# EasyEDA schematic 4 Channel Relay Board Omron.json

## Sheets
1 Relay Section copy: TITLE: Sheet_1; REV: 1.0; Date: 2022-12-17; Sheet: 1/1; Drawn By: Adarack; Company: Your Company
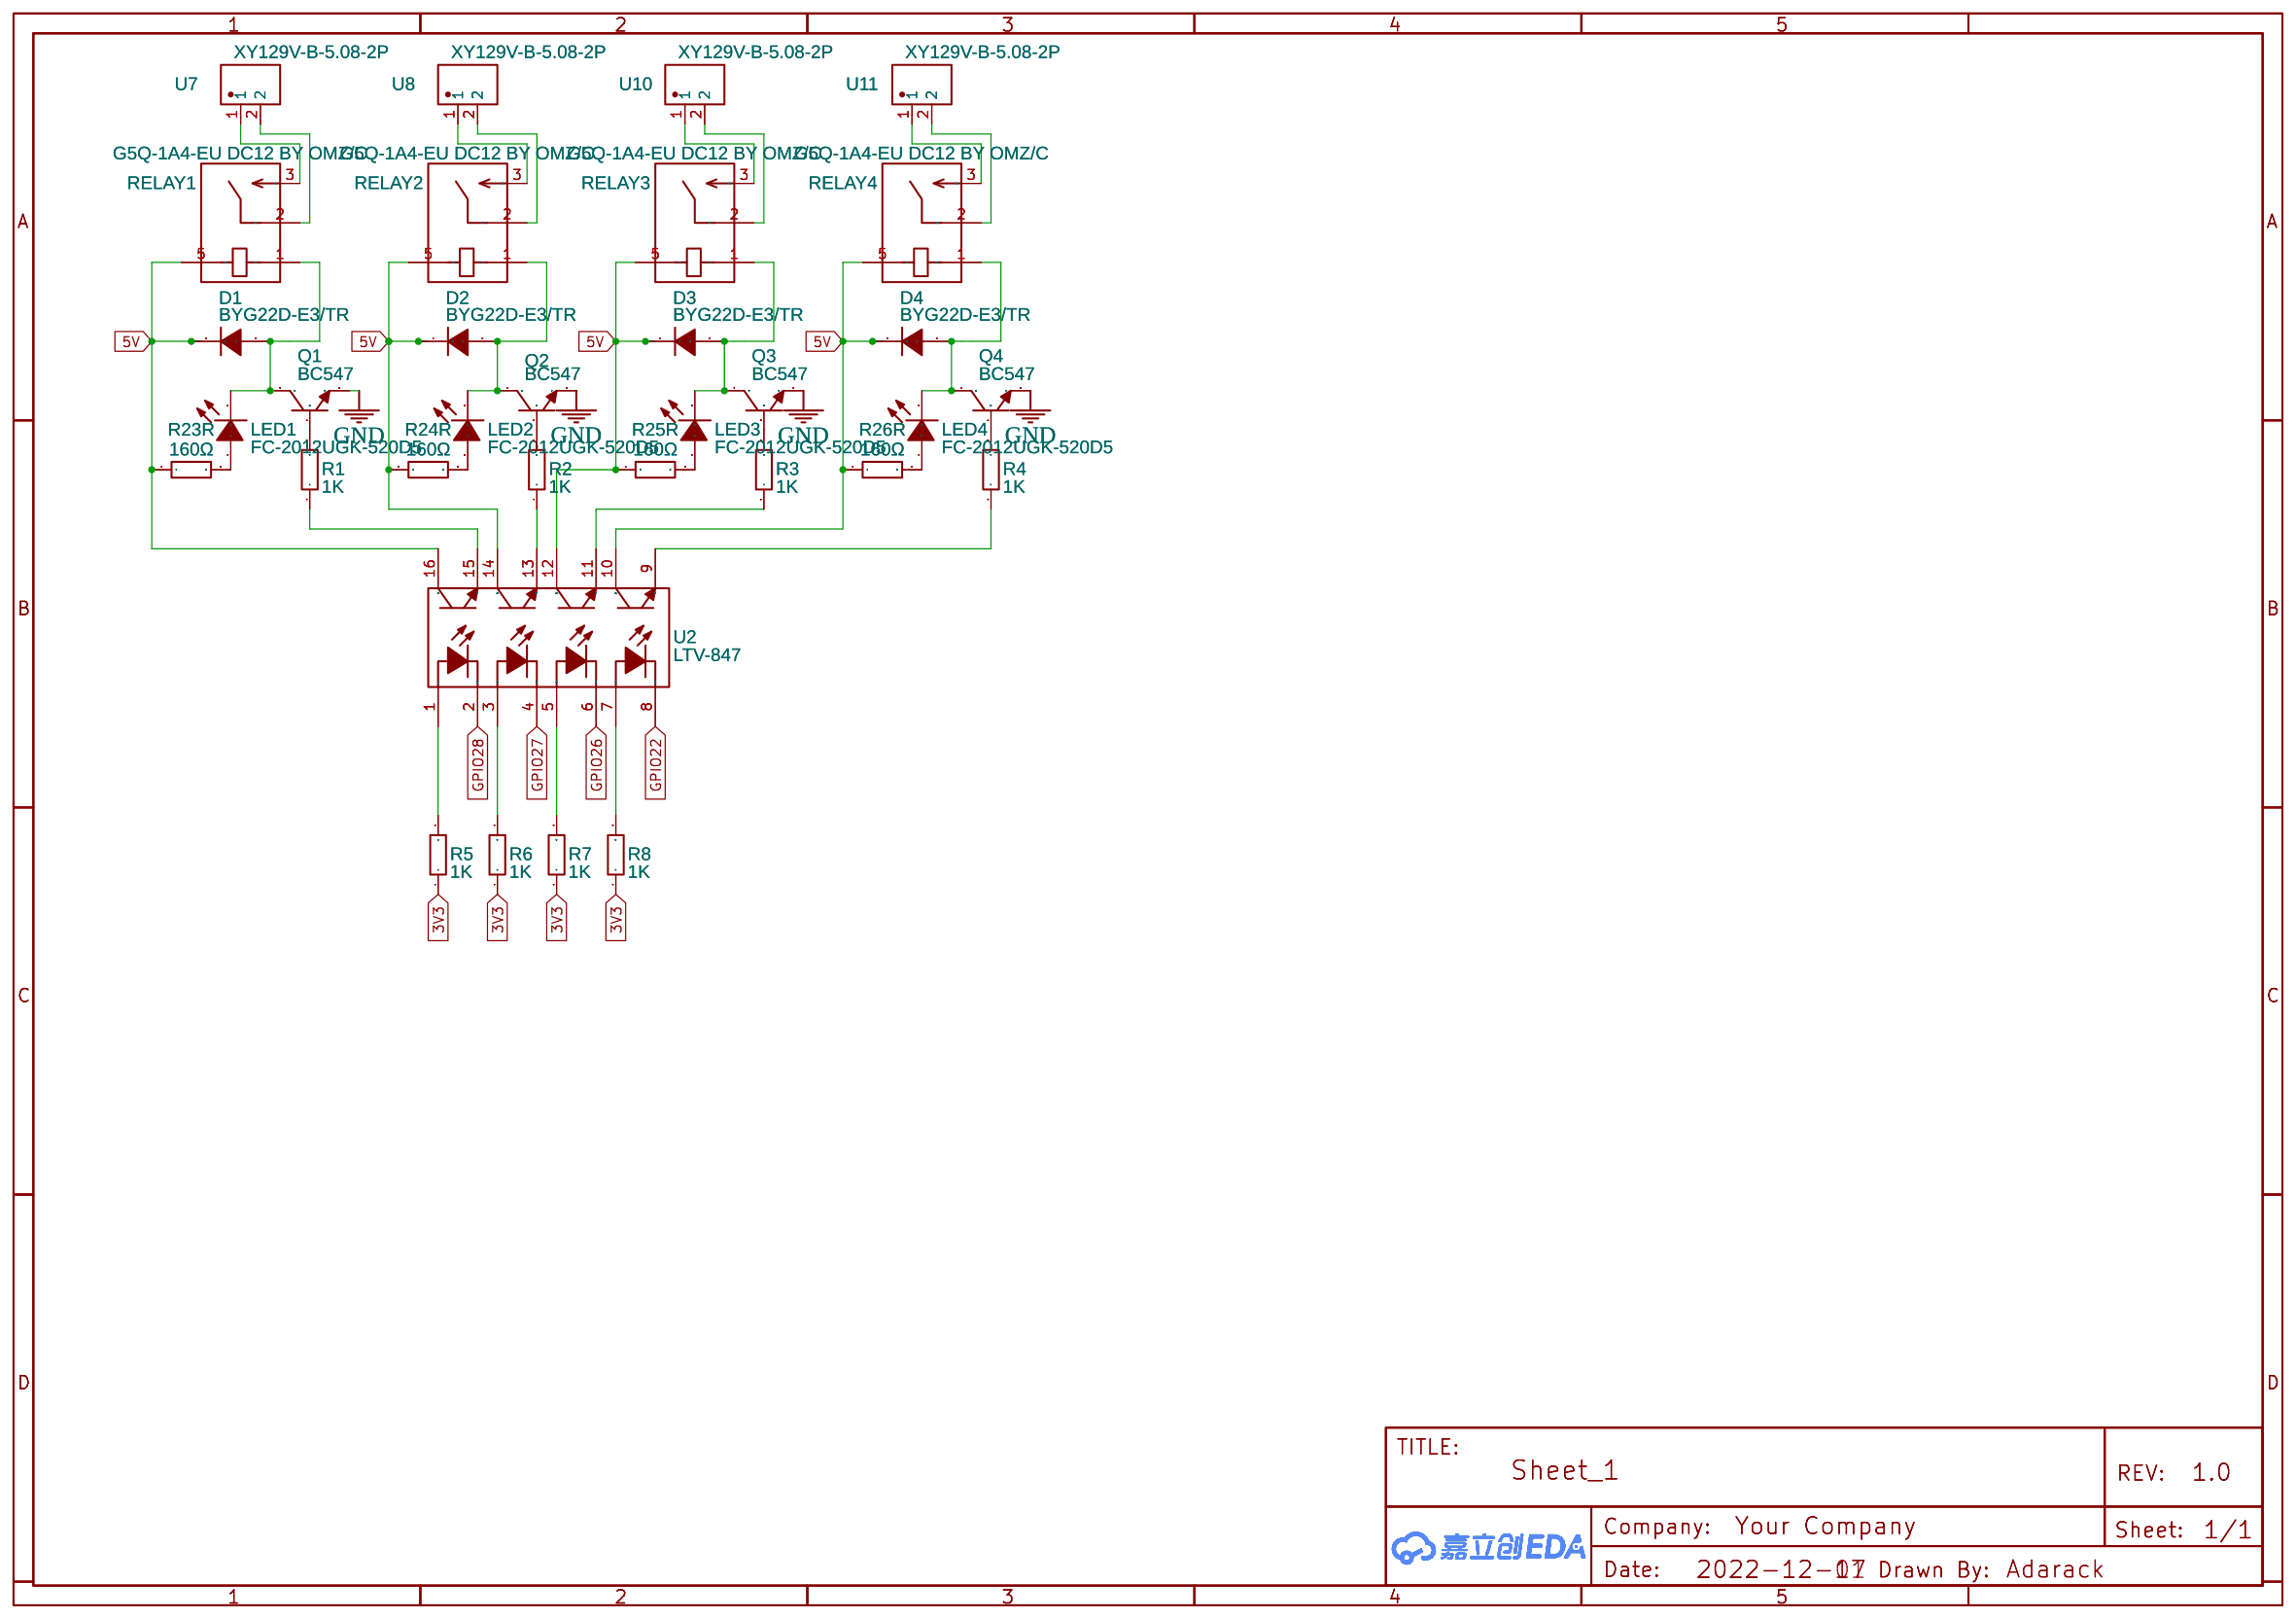
[diagram p0: Relay Section copy]
2 Pico W Section copy: TITLE: Sheet_2
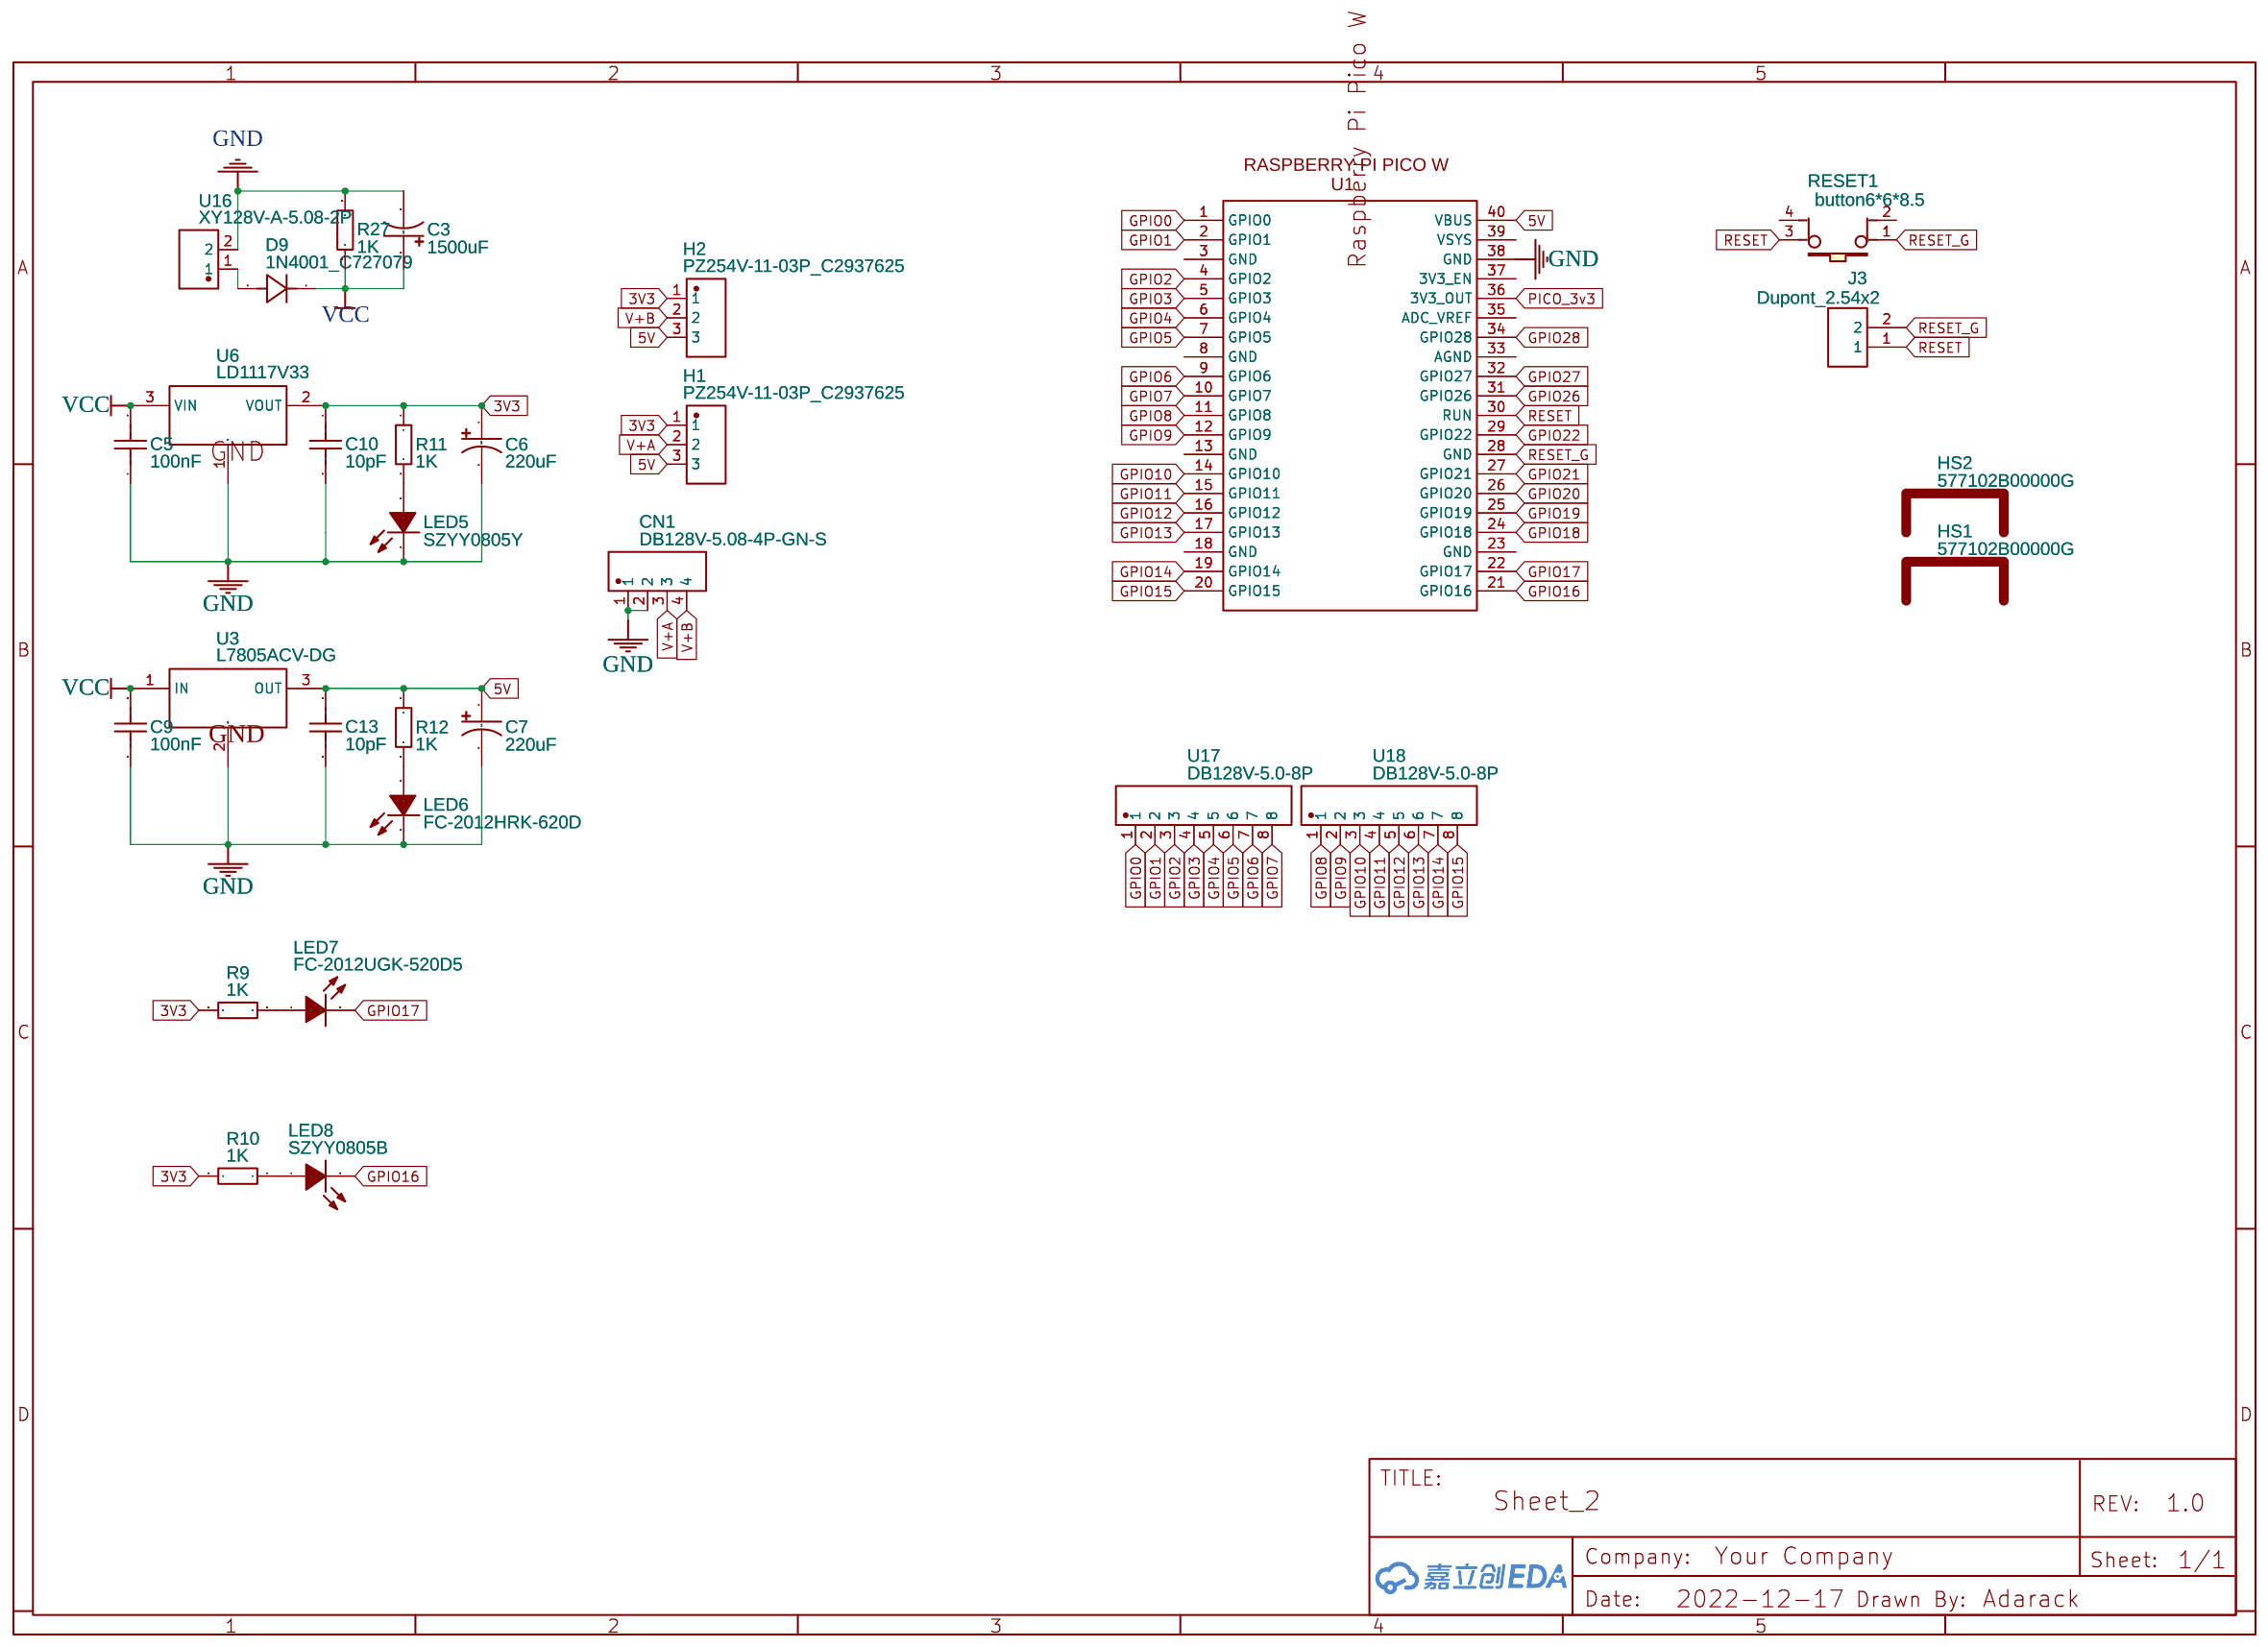
[diagram p1: Pico W Section copy]

## Parts
sheet Pico W Section copy
C3  1500uF  [CAP-TH_BD12.5-P5.00-D0.6-FD]
C5  100nF  [C0805]
C6  220uF  [CAP-TH_BD5.0-P2.00-D0.8-FD]
C7  220uF  [CAP-TH_BD5.0-P2.00-D0.8-FD]
C9  100nF  [C0805]
C10  10pF  [C0805]
C13  10pF  [C0805]
CN1  DB128V-5.08-4P-GN-S  [CONN-TH_4P-P5.08_DIBO_DB128V-5.08]
D9  1N4001_C727079  [SMA_L4.3-W2.5-LS5.0-RD]
H1  PZ254V-11-03P_C2937625  [HDR-TH_3P-P2.54-V-M]
H2  PZ254V-11-03P_C2937625  [HDR-TH_3P-P2.54-V-M]
HS1  577102B00000G  [577102B00000G]
HS2  577102B00000G  [577102B00000G]
J3  Dupont_2.54x2  [DUPONT 2.54_2]
LED5  SZYY0805Y  [LED0805-RD_YELLOW]
LED6  FC-2012HRK-620D  [LED0805-RD_RED]
LED7  FC-2012UGK-520D5  [LED0805-R-RD]
LED8  SZYY0805B  [LED0805-R-RD_BLUE]
R9  1K  [R0805]
R10  1K  [R0805]
R11  1K  [R0805]
R12  1K  [R0805]
R27  1K  [R0805]
RESET1  button6*6*8.5  [KEY-TH_4P-L6.0-W6.0-P4.50]
U3  L7805ACV-DG  [TO-220-3_L10.0-W4.5-P2.54-L]
U6  LD1117V33  [TO-220-3_L10.0-W4.5-P2.54-L]
U9  Raspberry Pi Pico W  [RASPBERRY PI PICO W HOLES CASTELLATED]
U16  XY128V-A-5.08-2P  [CONN-TH_XY128V-A-5.08-2P]
U17  DB128V-5.0-8P  [CONN-TH_8P-P5.00_DB128V-5.0-8P]
U18  DB128V-5.0-8P  [CONN-TH_8P-P5.00_DB128V-5.0-8P]
sheet Relay Section copy
D1  BYG22D-E3/TR  [SMA_L4.4-W2.8-LS5.4-RD]
D2  BYG22D-E3/TR  [SMA_L4.4-W2.8-LS5.4-RD]
D3  BYG22D-E3/TR  [SMA_L4.4-W2.8-LS5.4-RD]
D4  BYG22D-E3/TR  [SMA_L4.4-W2.8-LS5.4-RD]
LED1  FC-2012UGK-520D5  [LED0805-R-RD]
LED2  FC-2012UGK-520D5  [LED0805-R-RD]
LED3  FC-2012UGK-520D5  [LED0805-R-RD]
LED4  FC-2012UGK-520D5  [LED0805-R-RD]
Q1  BC547  [TO-92-3_L4.5-W3.5-P1.27-L]
Q2  BC547  [TO-92-3_L4.5-W3.5-P1.27-L]
Q3  BC547  [TO-92-3_L4.5-W3.5-P1.27-L]
Q4  BC547  [TO-92-3_L4.5-W3.5-P1.27-L]
R1  1K  [R0805]
R2  1K  [R0805]
R3  1K  [R0805]
R4  1K  [R0805]
R5  1K  [R0805]
R6  1K  [R0805]
R7  1K  [R0805]
R8  1K  [R0805]
R23R  160Ω  [R0805]
R24R  160Ω  [R0805]
R25R  160Ω  [R0805]
R26R  160Ω  [R0805]
RELAY1  G5Q-1A4-EU DC12 BY OMZ/C  [RELAY-TH_OMRON_G5Q-1A4-XX-XX-XX]
RELAY2  G5Q-1A4-EU DC12 BY OMZ/C  [RELAY-TH_OMRON_G5Q-1A4-XX-XX-XX]
RELAY3  G5Q-1A4-EU DC12 BY OMZ/C  [RELAY-TH_OMRON_G5Q-1A4-XX-XX-XX]
RELAY4  G5Q-1A4-EU DC12 BY OMZ/C  [RELAY-TH_OMRON_G5Q-1A4-XX-XX-XX]
U2  LTV-847  [DIP-16_16P-L20.2-W6.6-P2.54-LS7.6-BL]
U7  XY129V-B-5.08-2P  [CONN-TH_XY129V-B-5.08-2P]
U8  XY129V-B-5.08-2P  [CONN-TH_XY129V-B-5.08-2P]
U10  XY129V-B-5.08-2P  [CONN-TH_XY129V-B-5.08-2P]
U11  XY129V-B-5.08-2P  [CONN-TH_XY129V-B-5.08-2P]

## Library data of the parts
C3 = EGF158M1VI25RRSHP: Supplier: LCSC; Supplier Part: C238296; Manufacturer: Man Yue Tech; Contributor: LCSC; JLCPCB Part Class: Extended Part
C5 C9 = CC0805KRX7R8BB104: Supplier: LCSC; Supplier Part: C519981; Manufacturer: YAGEO(国巨); Contributor: LCSC; JLCPCB Part Class: Extended Part
C6 C7 = EEUFS0J221: Supplier: LCSC; Supplier Part: C407962; Manufacturer: PANASONIC(松下); Contributor: LCSC; JLCPCB Part Class: Extended Part
C10 C13 = 0805CG100J500NT: Supplier: LCSC; Manufacturer: FH(风华); Contributor: LCSC; Supplier Part: C157608; JLCPCB Part Class: Extended Part
CN1 = DB128V-5.08-4P-GN-S: Supplier: LCSC; Supplier Part: C2915641; Manufacturer: DIBO(地博电气); Contributor: LCSC; JLCPCB Part Class: Extended Part
D9 = 1N4001_C727079: Supplier: LCSC; Supplier Part: C727079; Manufacturer: TWGMC; Manufacturer Part: 1N4001; Contributor: LCSC; JLCPCB Part Class: Extended Part
H1 H2 = PZ254V-11-03P_C2937625: Supplier: LCSC; Supplier Part: C2937625; Manufacturer: XFCN(台湾兴飞); Manufacturer Part: PZ254V-11-03P; Contributor: LCSC; JLCPCB Part Class: Extended Part
HS1 HS2 = 577102B00000G: Manufacturer: Aavid; Supplier: Mouser; Supplier Part: 532-577102B00; Contributor: dylanmueller1302
J3 = Dupont_2.54x2: Contributor: govorukhin
LED5 = SZYY0805Y: Supplier: LCSC; Supplier Part: C434436; Manufacturer: yongyu(永裕光电); Contributor: LCSC; JLCPCB Part Class: Extended Part
LED6 = FC-2012HRK-620D: Supplier: LCSC; Manufacturer: NATIONSTAR; Supplier Part: C84256; JLCPCB Part Class: Basic Part
LED1-LED4 LED7 = FC-2012UGK-520D5: Supplier: LCSC; Manufacturer: 国星光电; Manufacturer Part: NCD0805G1; Supplier Part: C84260; JLCPCB Part Class: Extended Part
LED8 = SZYY0805B: Supplier: LCSC; Supplier Part: C434433; Manufacturer: yongyu(永裕光电); Contributor: LCSC; JLCPCB Part Class: Extended Part
R1-R12 R27 = RC0805FR-071KL: Supplier: LCSC; Manufacturer: YAGEO(国巨); Supplier Part: C95781; JLCPCB Part Class: Extended Part; Resistance: 1kΩ
RESET1 = button6*6*8.5: Supplier Part: C59980; Supplier: LCSC; Manufacturer: ReliaPro
U3 = L7805ACV-DG: Supplier: LCSC; Supplier Part: C472632; Manufacturer: STMicroelectronics; Contributor: LCSC; JLCPCB Part Class: Extended Part
U6 = LD1117V33: Supplier: LCSC; Supplier Part: C283467; Manufacturer: STMicroelectronics; Contributor: LCSC; JLCPCB Part Class: Extended Part
U9 = Raspberry Pi Pico W: Contributor: stienman
U16 = XY128V-A-5.08-2P: Supplier: LCSC; Supplier Part: C557665; Manufacturer: XINLAIYA(新莱亚); Contributor: LCSC; JLCPCB Part Class: Extended Part
U17 U18 = DB128V-5.0-8P: Supplier: LCSC; Supplier Part: C395863; Manufacturer: DIBO; Contributor: LCSC; JLCPCB Part Class: Extended Part
D1-D4 = BYG22D-E3/TR: Supplier: LCSC; Manufacturer: VISHAY(威世); Supplier Part: C52782; JLCPCB Part Class: Extended Part
Q1-Q4 = BC547: Supplier: LCSC; Supplier Part: C2910381; Manufacturer: CJ(江苏长电/长晶); link: https://atta.szlcsc.com/upload/public/pdf/source/20220322/35437BB3E522E0C3E451097265A180DC.pdf; Contributor: LCSC; JLCPCB Part Class: Extended Part
R23R R24R R25R R26R = 0805W8F1600T5E: Supplier: LCSC; Manufacturer: UNI-ROYAL(厚声); Supplier Part: C25269; Resistance (Ohms): 160; JLCPCB Part Class: Extended Part
RELAY1-RELAY4 = G5Q-1A4-EU DC12 BY OMZ/C: Supplier: LCSC; Supplier Part: C726027; Manufacturer: OMRON(欧姆龙); link: https://atta.szlcsc.comnull; Contributor: lcsc
U2 = LTV-847: Supplier: LCSC; Manufacturer: LITEON(光宝); Supplier Part: C10794; JLCPCB Part Class: Extended Part
U7 U8 U10 U11 = XY129V-B-5.08-2P: Supplier: LCSC; Supplier Part: C557671; Manufacturer: --; Contributor: LCSC; JLCPCB Part Class: Extended Part

## Nets
3V3: C6.1 C10.1 H1.1 H2.1 R5.1 R6.1 R7.1 R8.1 R9.2 R10.2 R11.1 U6.2(VOUT)
5V: C7.1 C13.1 D1.1(K) D2.1(K) D3.1(K) D4.1(K) H1.3 H2.3 R12.1 R23R.1 R24R.1 R25R.1 R26R.1 RELAY1.5 RELAY2.5 RELAY3.5 RELAY4.5 U2.10(COL) U2.12(COL) U2.14(COL) U2.16(COL) U3.3(OUT) U9.40(VBUS)
GND: C3.2 C5.1 C6.2 C7.2 C9.1 C10.2 C13.2 CN1.1 CN1.2 LED5.1(-) LED6.1(-) Q1.3(E) Q2.3(E) Q3.3(E) Q4.3(E) R27.2 U3.2(GND) U6.1(GND) U9.38(GND) U16.2
VCC: C3.1 C5.2 C9.2 D9.1(K) R27.1 U3.1(IN) U6.3(VIN)
GPIO0: U9.1(GPIO0) U17.1
GPIO1: U9.2(GPIO1) U17.2
GPIO2: U9.4(GPIO2) U17.3
GPIO3: U9.5(GPIO3) U17.4
GPIO4: U9.6(GPIO4) U17.5
GPIO5: U9.7(GPIO5) U17.6
GPIO6: U9.9(GPIO6) U17.7
GPIO7: U9.10(GPIO7) U17.8
GPIO8: U9.11(GPIO8) U18.1
GPIO9: U9.12(GPIO9) U18.2
GPIO10: U9.14(GPIO10) U18.3
GPIO11: U9.15(GPIO11) U18.4
GPIO12: U9.16(GPIO12) U18.5
GPIO13: U9.17(GPIO13) U18.6
GPIO14: U9.19(GPIO14) U18.7
GPIO15: U9.20(GPIO15) U18.8
GPIO16: LED8.2(-) U9.21(GPIO16)
GPIO17: LED7.2(K) U9.22(GPIO17)
GPIO18: U9.24(GPIO18)
GPIO19: U9.25(GPIO19)
GPIO20: U9.26(GPIO20)
GPIO21: U9.27(GPIO21)
GPIO22: U2.8(CAT) U9.29(GPIO22)
GPIO26: U2.6(CAT) U9.31(GPIO26)
GPIO27: U2.4(CAT) U9.32(GPIO27)
GPIO28: U2.2(CAT) U9.34(GPIO28)
PICO_3v3: U9.36(3V3 OUT)
RESET: J3.1 RESET1.3 U9.30(RUN)
RESET_G: J3.2 RESET1.1 U9.28(GND)
V+A: CN1.3 H1.2
V+B: CN1.4 H2.2
Net-(D1-2): D1.2(A) LED1.2(K) Q1.1(C) RELAY1.1
Net-(D2-2): D2.2(A) LED2.2(K) Q2.1(C) RELAY2.1
Net-(D3-2): D3.2(A) LED3.2(K) Q3.1(C) RELAY3.1
Net-(D4-2): D4.2(A) LED4.2(K) Q4.1(C) RELAY4.1
Net-(D9-2): D9.2(A) U16.1
Net-(LED1-1): LED1.1(A) R23R.2
Net-(LED2-1): LED2.1(A) R24R.2
Net-(LED3-1): LED3.1(A) R25R.2
Net-(LED4-1): LED4.1(A) R26R.2
Net-(LED5-2): LED5.2(+) R11.2
Net-(LED6-2): LED6.2(+) R12.2
Net-(LED7-1): LED7.1(A) R9.1
Net-(LED8-1): LED8.1(+) R10.1
Net-(Q1-2): Q1.2(B) R1.2
Net-(Q2-2): Q2.2(B) R2.2
Net-(Q3-2): Q3.2(B) R3.2
Net-(Q4-2): Q4.2(B) R4.2
Net-(R1-1): R1.1 U2.15(EM)
Net-(R2-1): R2.1 U2.13(EM)
Net-(R3-1): R3.1 U2.11(EM)
Net-(R4-1): R4.1 U2.9(EM)
Net-(R5-2): R5.2 U2.1(AN)
Net-(R6-2): R6.2 U2.3(AN)
Net-(R7-2): R7.2 U2.5(AN)
Net-(R8-2): R8.2 U2.7(AN)
Net-(RELAY1-2): RELAY1.2 U7.2
Net-(RELAY1-3): RELAY1.3 U7.1
Net-(RELAY2-2): RELAY2.2 U8.2
Net-(RELAY2-3): RELAY2.3 U8.1
Net-(RELAY3-2): RELAY3.2 U10.2
Net-(RELAY3-3): RELAY3.3 U10.1
Net-(RELAY4-2): RELAY4.2 U11.2
Net-(RELAY4-3): RELAY4.3 U11.1

Not connected (* = marked no-connect by the designer): RESET1 2 4; U9 3(GND) 8(GND) 13(GND) 18(GND) 23(GND) 33(AGND) 35(ADC VREF) 37(3V3_EN) 39(VSYS)
